# EAGLE design schematic (EAGLE 5.04)
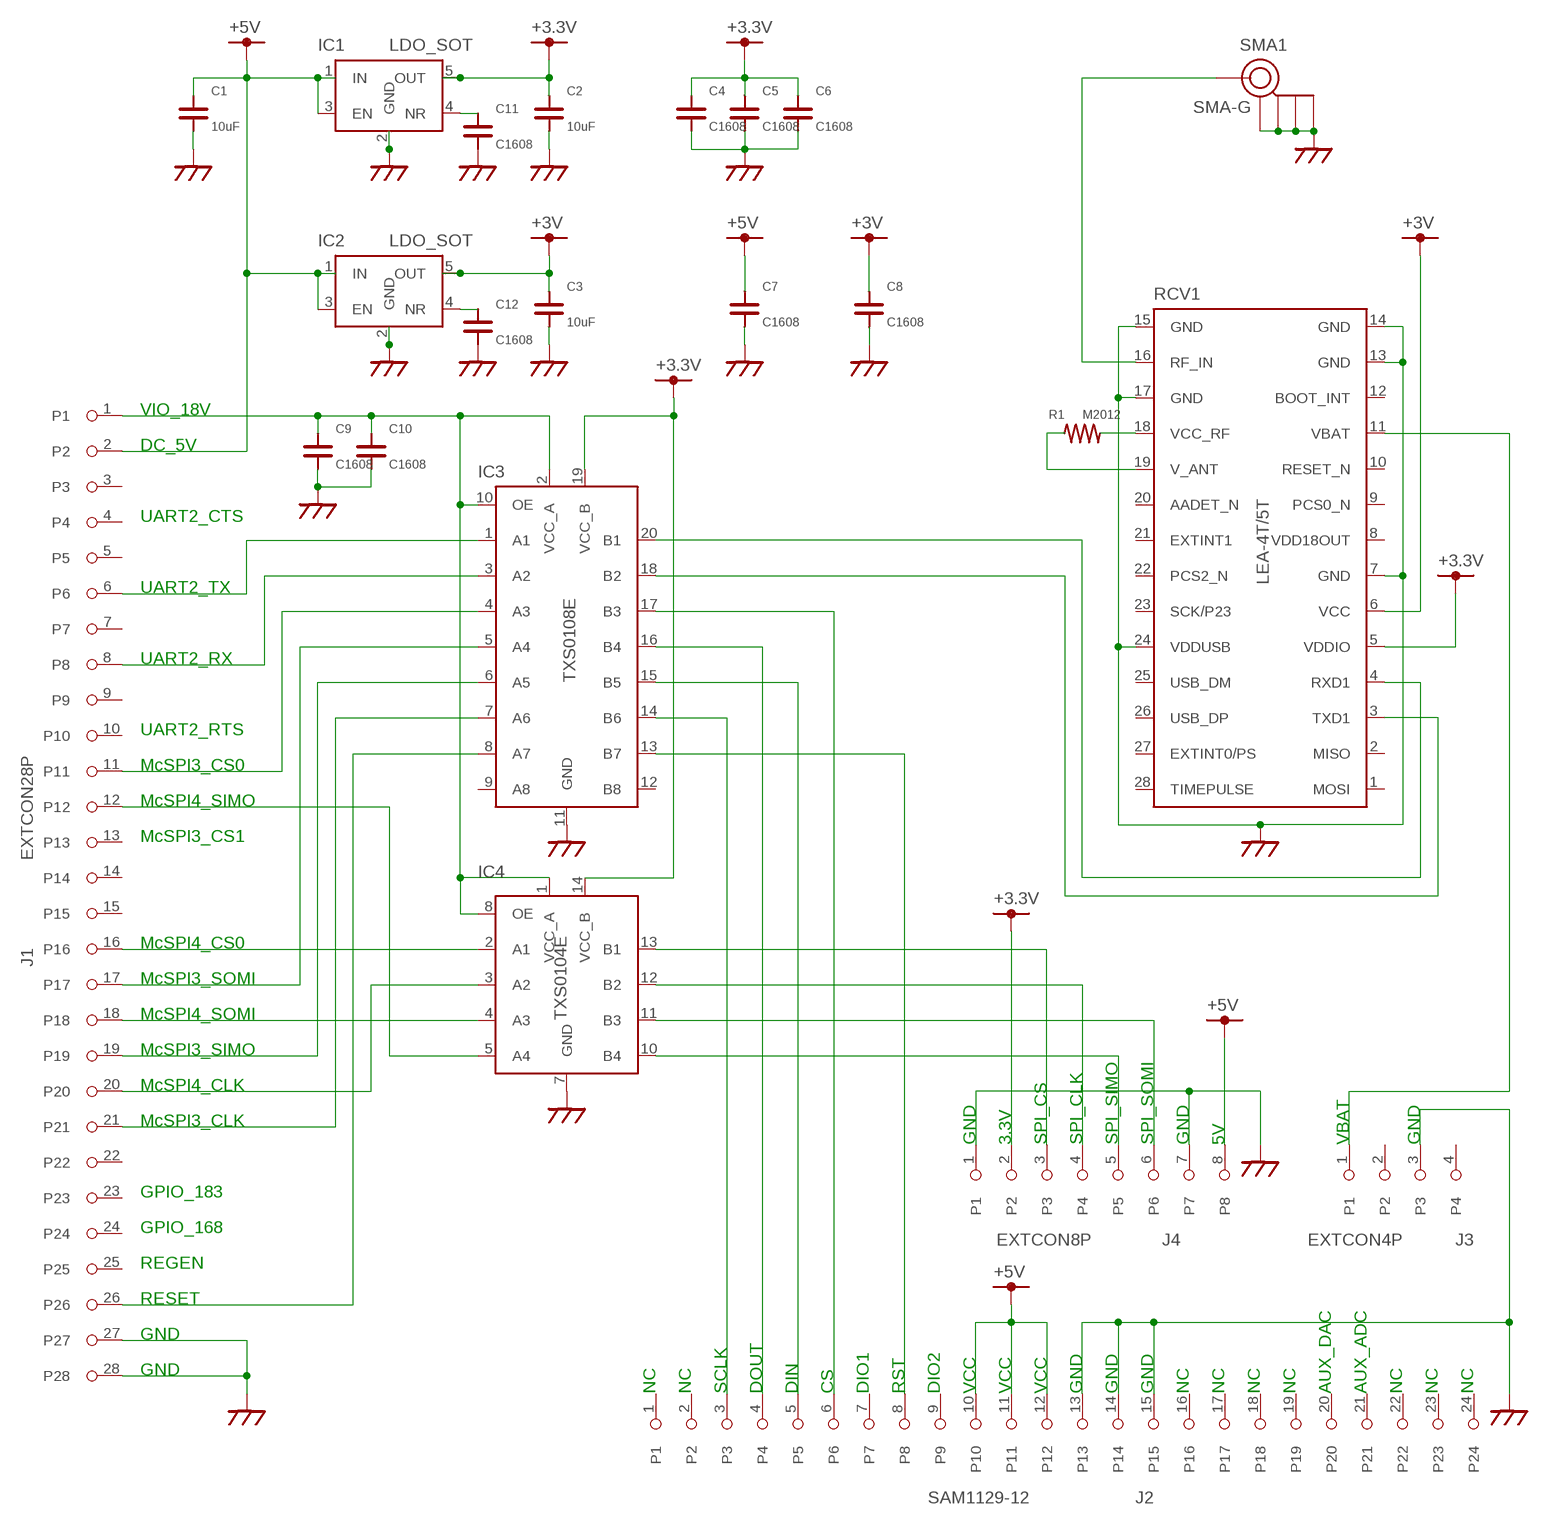
[diagram p0: schematic, sheet 1]

## Parts
C1  10uF  C3225  [C3225]
C2  10uF  C3225  [C3225]
C3  10uF  C3225  [C3225]
C4  C1608  [C1608]
C5  C1608  [C1608]
C6  C1608  [C1608]
C7  C1608  [C1608]
C8  C1608  [C1608]
C9  C1608  [C1608]
C10  C1608  [C1608]
C11  C1608  [C1608]
C12  C1608  [C1608]
IC1  LDO_SOT  [SOT23]
IC2  LDO_SOT  [SOT23]
IC3  TXS0108E  [SSOP20]
IC4  TXS0104E  [SSOP14]
J1  EXTCON28P  [EXTCON28P]
J2  SAM1129-12  [SAM1129-12]
J3  EXTCON4P  [PINH-2MM-4P]
J4  EXTCON8P  [PINH-2MM-8P]
R1  M2012  [M2012]
RCV1  LEA-4T/5T  LEA-4T  [LEA-4T]
SMA1  SMA-G  [SMA-G]

## Nets
1.8V [pow]: C9.1 C10.1 IC3.2(VCC_A) IC3.10(OE) IC4.1(VCC_A) IC4.8(OE) J1.1
+3.3V [pow]: C2.P$1 C4.1 C5.1 C6.1 IC1.5(OUT) IC3.19(VCC_B) IC4.14(VCC_B) J4.2 RCV1.5(VDDIO)
+3V [pow]: C3.P$1 C8.1 IC2.5(OUT) RCV1.6(VCC)
+5V [pow]: C1.P$1 C7.1 IC1.1(IN) IC1.3(EN) IC2.1(IN) IC2.3(EN) J1.2 J2.10 J2.11 J2.12 J4.8
GND [gnd]: C1.P$2 C2.P$2 C3.P$2 C4.2 C5.2 C6.2 C7.2 C8.2 C9.2 C10.2 C11.2 C12.2 IC1.2(GND) IC2.2(GND) IC3.11(GND) IC4.7(GND) J1.27 J1.28 J2.13 J2.14 J2.15 J3.3 J4.1 J4.7 RCV1.7(GND) RCV1.13(GND) RCV1.14(GND) RCV1.15(GND) RCV1.17(GND) RCV1.24(VDDUSB) SMA1.2(GND) SMA1.3(GND) SMA1.4(GND) SMA1.5(GND)
N$1: J3.1 RCV1.11(VBAT)
N$2: IC3.3(A2) J1.8
N$3: C12.1 IC2.4(NR)
N$4: IC3.1(A1) J1.6
N$5: IC3.4(A3) J1.11
N$6: R1.1 RCV1.19(V_ANT)
N$7: C11.1 IC1.4(NR)
N$8: IC3.20(B1) RCV1.4(RXD1)
N$9 [rf]: RCV1.16(RF_IN) SMA1.1(RF)
N$10: IC4.2(A1) J1.16
N$11: IC4.3(A2) J1.20
N$12: IC4.4(A3) J1.18
N$13: IC4.5(A4) J1.12
N$15: IC4.13(B1) J4.3
N$16: IC4.12(B2) J4.4
N$17: IC4.11(B3) J4.6
N$18: IC4.10(B4) J4.5
N$21: IC3.18(B2) RCV1.3(TXD1)
N$23: IC3.13(B7) J2.8
N$42: IC3.5(A4) J1.17
N$43: IC3.6(A5) J1.19
N$44: IC3.7(A6) J1.21
N$45: IC3.8(A7) J1.26
N$62: IC3.14(B6) J2.3
N$63: IC3.16(B4) J2.4
N$64: IC3.15(B5) J2.5
N$65: IC3.17(B3) J2.6
N$67: R1.2 RCV1.18(VCC_RF)
Unconnected: IC3.9(A8) IC3.12(B8) J1.3 J1.4 J1.5 J1.7 J1.9 J1.10 J1.13 J1.14 J1.15 J1.22 J1.23 J1.24 J1.25 J2.1 J2.2 J2.7 J2.9 J2.16 J2.17 J2.18 J2.19 J2.20 J2.21 J2.22 J2.23 J2.24 J3.2 J3.4 RCV1.1(MOSI) RCV1.2(MISO) RCV1.8(VDD18OUT) RCV1.9(PCS0_N) RCV1.10(RESET_N) RCV1.12(BOOT_INT) RCV1.20(AADET_N) RCV1.21(EXTINT1) RCV1.22(PCS2_N) RCV1.23(SCK/P23) RCV1.25(USB_DM) RCV1.26(USB_DP) RCV1.27(EXTINT0/PS) RCV1.28(TIMEPULSE)

## Notes on the sheet
- VIO_18V
- DC_5V
- UART2_CTS
- UART2_TX
- UART2_RX
- UART2_RTS
- McSPI3_CS0
- McSPI4_SIMO
- McSPI3_CS1
- McSPI4_CS0
- McSPI3_SOMI
- McSPI4_SOMI
- McSPI3_SIMO
- McSPI4_CLK
- McSPI3_CLK
- GND | 3.3V | SPI_CS | SPI_CLK | SPI_SIMO | SPI_SOMI | GND | 5V | VBAT | GND
- GPIO_183
- GPIO_168
- REGEN
- RESET
- GND
- GND
- NC | NC | SCLK | DOUT | DIN | CS | DIO1 | RST | DIO2 | VCC | VCC | VCC | GND | GND | GND | NC | NC | NC | NC | AUX_DAC | AUX_ADC | NC | NC | NC

## Library data of the parts
C1-C3 = ublox:C3225
C4-C12 = ublox:C1608
IC1 IC2 = ublox:LDO_SOT
IC3 = ublox:TXS0108E
IC4 = ublox:TXS0104E
J1 = ublox:EXTCON28P
J2 = ublox:SAM1129-12
J3 = ublox:EXTCON4P
J4 = ublox:EXTCON8P
R1 = ublox:M2012
RCV1 = ublox:LEA-4T: LEA-4T u-blox GPS receiver module
SMA1 = ublox:SMA-G: SMA-G

## Net classes
1 pow: width 0.254 mm
2 gnd: width 0.254 mm
3 rf: width 0.254 mm

## Board
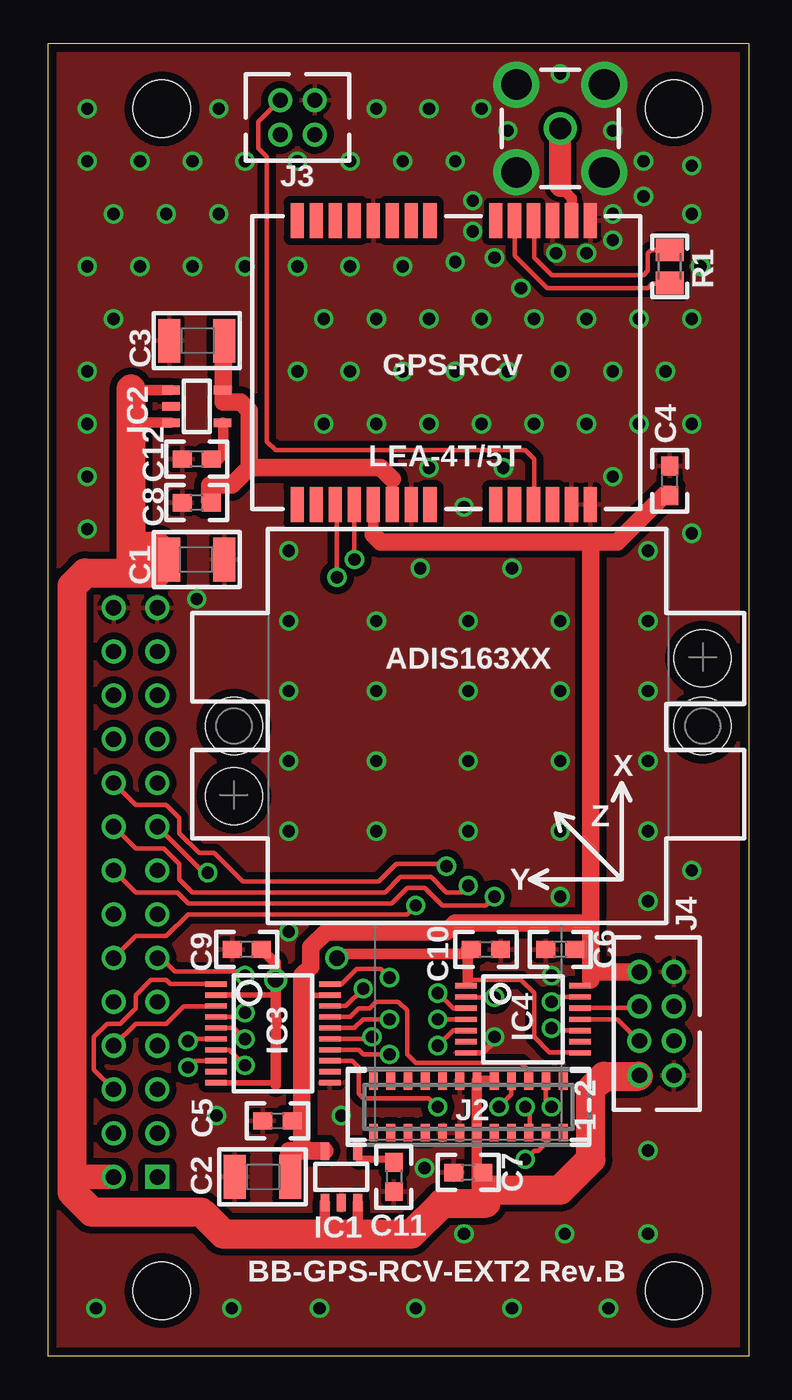
[diagram p1: board, top side]
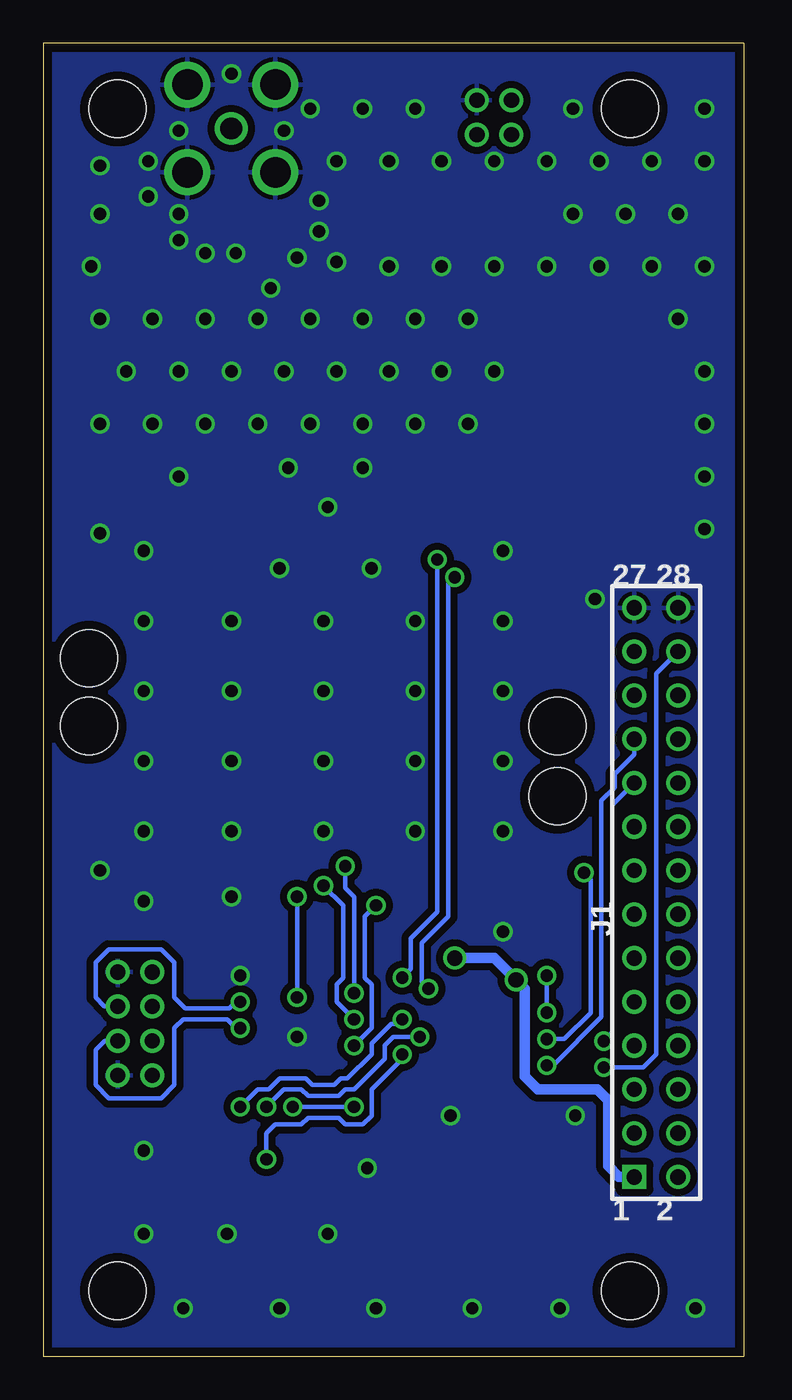
[diagram p2: board, bottom side, seen from below]

Size 40.64 x 76.2 mm. Coordinates in mm from the lower left corner, seen from the top.
Outline: 0,76.2 40.64,76.2 40.64,0 0,0 0,76.2
Copper layers (1*16): Top 0.0356mm / dielectric 1.5011mm / Bottom 0.0356mm
Design rules "SilverCircuits": minimum track width 8mil, minimum drill 24mil, track to track 12mil, track to pad 12mil, pad to pad 12mil, via to via 12mil, smd to smd 0mil, copper to edge 20mil, drill to drill 8mil, minimum pad ring 10mil, minimum via ring 8mil, stop-mask expansion 4mil, vias tented up to drill 0mil, thermal gap 10mil
Holes 3.3 mm at 6.6,72.39 6.6,3.81 36.32,3.81 36.32,72.39 10.79,32.51 37.97,40.51 37.97,36.58 10.79,36.58

### Footprints (pad centres in the part's own frame; a part is rotated, then mirrored left to right if it is on the bottom)
C3225 = smd 2.54 x 1.27: P$1 0,1.6; P$2 0,-1.6
C1608 = smd 1.1 x 1: 1 -0.85,0; 2 0.85,0
SOT23 = smd 0.508 x 1.016: 1 -0.95,-1.5; 2 0,-1.5; 3 0.95,-1.5; 4 0.95,1.5; 5 -0.95,1.5
SSOP20 = smd 0.305 x 1.245: 1 -2.857,-3.302; 2 -2.222,-3.302; 3 -1.587,-3.302; 4 -0.952,-3.302; 5 -0.317,-3.302; 6 0.318,-3.302; 7 0.953,-3.302; 8 1.588,-3.302; 9 2.223,-3.302; 10 2.858,-3.302; 11 2.858,3.302; 12 2.223,3.302; 13 1.588,3.302; 14 0.953,3.302; 15 0.318,3.302; 16 -0.317,3.302; 17 -0.952,3.302; 18 -1.587,3.302; 19 -2.222,3.302; 20 -2.857,3.302
SSOP14 = smd 0.304 x 1.245: 1 -1.95,-3.3; 2 -1.3,-3.3; 3 -0.65,-3.3; 4 0,-3.3; 5 0.65,-3.3; 6 1.3,-3.3; 7 1.95,-3.3; 8 1.95,3.3; 9 1.3,3.3; 10 0.65,3.3; 11 0,3.3; 12 -0.65,3.3; 13 -1.3,3.3; 14 -1.95,3.3
EXTCON28P = drill 0.889 square: 1 -1.27,-16.51 | drill 0.889 round: 2 1.27,-16.51; 3 -1.27,-13.97; 4 1.27,-13.97; 5 -1.27,-11.43; 6 1.27,-11.43; 7 -1.27,-8.89; 8 1.27,-8.89; 9 -1.27,-6.35; 10 1.27,-6.35; 11 -1.27,-3.81; 12 1.27,-3.81; 13 -1.27,-1.27; 14 1.27,-1.27; 15 -1.27,1.27; 16 1.27,1.27; 17 -1.27,3.81; 18 1.27,3.81; 19 -1.27,6.35; 20 1.27,6.35; 21 -1.27,8.89; 22 1.27,8.89; 23 -1.27,11.43; 24 1.27,11.43; 25 -1.27,13.97; 26 1.27,13.97; 27 -1.27,16.51; 28 1.27,16.51
SAM1129-12 = smd 1.016 x 0.508: 1 -1.5,-5.5; 2 1.5,-5.5; 3 -1.5,-4.5; 4 1.5,-4.5; 5 -1.5,-3.5; 6 1.5,-3.5; 7 -1.5,-2.5; 8 1.5,-2.5; 9 -1.5,-1.5; 10 1.5,-1.5; 11 -1.5,-0.5; 12 1.5,-0.5; 13 -1.5,0.5; 14 1.5,0.5; 15 -1.5,1.5; 16 1.5,1.5; 17 -1.5,2.5; 18 1.5,2.5; 19 -1.5,3.5; 20 1.5,3.5; 21 -1.5,4.5; 22 1.5,4.5; 23 -1.5,5.5; 24 1.5,5.5
PINH-2MM-4P = drill 0.889 round: 1 1,-1; 2 1,1; 3 -1,-1; 4 -1,1
PINH-2MM-8P = drill 0.889 round: 1 3,-1; 2 3,1; 3 1,-1; 4 1,1; 5 -1,-1; 6 -1,1; 7 -3,-1; 8 -3,1
M2012 = smd 1.3 x 1.6: 1 -0.95,0; 2 0.95,0
LEA-4T = smd 2.032 x 0.762: 1 8.246,-8.65; 2 8.246,-7.55; 3 8.246,-6.45; 4 8.246,-5.35; 5 8.246,-4.25; 6 8.246,-3.15; 7 8.246,-2.05; 8 8.246,-0.95; 9 8.246,2.85; 10 8.246,3.95; 11 8.246,5.05; 12 8.246,6.15; 13 8.246,7.25; 14 8.246,8.35; 15 -8.246,8.35; 16 -8.246,7.25; 17 -8.246,6.15; 18 -8.246,5.05; 19 -8.246,3.95; 20 -8.246,2.85; 21 -8.246,-0.95; 22 -8.246,-2.05; 23 -8.246,-3.15; 24 -8.246,-4.25; 25 -8.246,-5.35; 26 -8.246,-6.45; 27 -8.246,-7.55; 28 -8.246,-8.65
SMA-G = drill 1.27 round: 1 0,0 | drill 1.778 round: 2 -2.55,2.55; 3 2.55,2.55; 4 2.55,-2.55; 5 -2.55,-2.55

### Placement (x,y rotation side)
ADIS163XX  [ADIS]  24.38,36.58 0 top
C1  8.64,46.23 90 top
C2  12.45,10.41 270 top
C3  8.64,58.93 270 top
C4  36.07,50.8 90 top
C5  13.31,13.67 180 top
C6  29.72,23.62 180 top
C7  24.38,10.67 180 top
C8  8.64,49.53 180 top
C9  11.53,23.62 180 top
C10  25.4,23.62 0 top
C11  20.07,10.41 270 top
C12  8.64,52.07 180 top
IC1  17.02,10.41 0 top
IC2  8.64,55.12 270 top
IC3  13.06,18.75 270 top
IC4  27.56,19.56 270 top
J1  5.08,26.92 0 bottom
J2  24.38,14.48 90 top
J3  14.48,71.88 180 top
J4  35.31,19.3 90 top
R1  36.07,63.25 90 top
RCV1  23.11,57.66 270 top
SMA1  29.72,71.25 180 top

### Tracks (layer width: path | path; a pad name or v marks a point on that pad's centre or on a via)
1.8V  (via drill 0.89)
  Top 0.254: 24.34,21.84 27.43,21.84 28.19,21.08 28.19,18.54 29.08,17.65 30.86,17.65 IC4.8 | 9.77,15.88 IC3.10
  Top 0.305: 24.34,21.59 IC4.1 | IC3.2 13.09,20.97 13.21,21.08 | 9.77,15.88 13.08,15.88 13.21,16
  Top 0.406: C10.1 24.64,23.62 | 24.38,23.37 24.38,23.46 | 24.34,21.84 24.34,21.59
  Top 0.61: v16.76,23.11 17.02,23.37 24.38,23.37 | 24.34,21.84 24.34,23.41 24.38,23.46 | 13.21,15.75 13.21,16 13.21,21.08 v13.21,21.84 13.21,22.86 13.14,22.86 C9.1 12.45,23.56
  Top 1.016: 24.38,23.46 C10.1
  Bottom 0.61: v16.76,23.11 14.48,23.11 v13.21,21.84 12.7,21.34 12.7,16.26 11.94,15.49 8.51,15.49 7.87,14.86 7.87,11.05 7.24,10.41 J1.1
+3.3V
  Top 0.305: IC3.19 16.34,20.95 14.86,20.95 | IC4.14 31.16,21.51 31.5,21.84
  Top 0.61: 18.86,47.68 RCV1.5 | 14.73,21.08 14.86,20.95
  Top 1.016: 31.5,47.24 33.02,47.24 35.81,50.04 35.98,50.04 C4.1 36.07,50.04 | 14.73,11.94 14.73,13.72 | 14.73,13.72 14.73,21.08 14.73,22.1 15.24,22.61 15.24,23.75 16.13,24.64 23.11,24.64 23.62,25.15 31.5,25.15 | 14.17,13.66 C5.1 14.68,13.66 14.73,13.72 | 14.48,11.94 14.45,11.91 14.73,11.91 | 31.5,47.24 19.3,47.24 18.86,47.68 | 31.5,23.62 C6.1 | 14.73,11.91 IC1.5 | C2.P$1 14.05,10.85 13.97,10.92 13.97,11.94 14.73,11.94 | 31.5,25.15 31.5,47.24 | 14.73,11.94 14.73,11.91 | 31.5,23.62 31.5,22.35 | 31.5,22.35 31.5,21.84 | J4.2 31.54,22.3 31.5,22.35 | 31.5,25.15 31.5,23.62
+3V
  Top 0.61: 19.96,50.9 RCV1.6
  Top 1.016: 19.96,50.9 19.3,51.56 11.68,51.56 | 11.68,51.56 11.68,54.86 11.18,55.37 10.16,55.37 10.16,56.13 | 10.14,58.83 C3.P$1 10.16,58.85 10.16,56.13 | 11.68,51.56 10.67,50.55 9.4,50.55 9.4,49.62 C8.1 | IC2.5 10.14,56.11 10.16,56.13
+5V
  Top 0.61: 18.03,7.11 17.97,7.18 IC1.3 | 16,7.11 16.07,7.18 IC1.1 | J2.10 J2.12 J2.11 24.88,10.92 | 24.88,10.92 24.88,9.75 25.4,9.75 25.4,9.65 | C7.1 24.88,10.67 24.88,10.92 | 4.89,56.07 IC2.1 | 5.01,54.17 IC2.3
  Top 0.813: 4.83,56.13 4.89,56.07 | 4.83,54.36 5.01,54.17 | 6.35,46.23 C1.P$1
  Top 1.016: 34.29,16.29 J4.8 34.26,16.26
  Top 1.422: 4.83,47.24 4.83,46.99 | 4.83,45.72 4.83,46.74 5.08,46.99 | 1.4,10.41 J1.2
  Top 1.676: 4.83,45.72 4.83,47.24 4.83,54.36 4.83,56.13 | 5.08,46.99 6.35,46.99 6.35,46.23 6.35,45.47 2.16,45.47 1.4,44.7 1.4,10.41 1.4,9.53 2.54,8.38 8.89,8.38 10.16,7.11 16,7.11 18.03,7.11 21.08,7.11 22.86,8.89 25.4,8.89 25.4,9.65 29.72,9.65 31.5,11.43 31.5,15.49 32.26,16.26 34.26,16.26
GND  (via drill 0.71)
  Top 0.305: IC4.7 25.23,17.61 25.91,18.29
  Top 0.406: 25.91,18.29 v25.91,18.54
  other vias: 29.21,22.1 32.51,2.79 14.48,63.25 17.53,63.25 24.64,67.06 23.62,63.5 32.77,64.77 32.77,66.29 37.34,66.29 23.62,69.34 34.29,60.2 31.24,60.2 28.19,60.2 25.15,60.2 22.1,60.2 19.05,60.2 16,60.2 32.77,51.05 14.48,57.15 17.53,57.15 20.57,57.15 23.62,57.15 26.67,57.15 29.72,57.15 32.77,57.15 35.81,57.15 31.24,54.1 28.19,54.1 25.15,54.1 22.1,54.1 19.05,54.1 16,54.1 24.13,49.28 25.91,63.75 24.64,65.28 29.46,64.01 37.34,69.09 34.29,54.1 20.57,63.25 34.54,67.31 34.54,69.34 32.77,71.12 29.72,74.42 26.67,71.12 25.15,72.39 27.43,61.98 22.1,72.39 19.05,72.39 20.57,69.34 17.53,69.34 14.48,69.34 34.8,11.94 37.34,28.19 11.43,69.34 26.42,51.56 11.43,63.25 9.91,66.29 37.34,60.2 29.97,7.11 29.72,42.67 13.97,42.67 29.72,26.67 5.33,69.34 24.38,42.67 34.8,7.11 24.38,38.61 9.78,13.97 19.05,42.67 22.1,51.56 29.72,38.61 13.97,34.54 15.75,2.79 24.13,7.11 37.34,47.75 26.92,2.79 10.67,2.79 8.38,69.34 37.34,54.1 6.86,66.29 3.81,66.29 9.91,72.39 2.29,69.34 2.29,63.25 2.29,51.05 31.24,64.01 13.97,46.74 13.97,38.61 13.97,24.64 13.97,30.48 21.84,10.92 19.05,34.54 19.05,30.48 21.34,2.79 34.8,26.42 34.8,30.48 34.8,34.54 34.8,38.61 34.8,42.67 2.79,2.79 19.05,38.61 26.92,45.72 21.59,45.72 29.72,34.54 29.72,30.48 24.38,30.48 24.38,34.54 2.29,57.15 2.29,54.1 2.29,48.01 2.29,72.39 8.38,63.25 3.81,60.2 8.64,43.94 37.85,63.25 34.8,46.74 17.02,13.97 5.33,63.25
  pour Bottom (isolate 0.406): -1.78,77.98 42.42,77.98 42.42,-2.03 -1.78,-2.03
  pour Top (isolate 0.406): -0.76,76.96 25.4,76.96 25.4,66.8 34.04,66.8 34.04,76.96 41.4,76.96 41.4,-1.02 -0.76,-1.02
  pour Top (isolate 0.254, no thermals): 23.62,77.72 23.62,66.29 35.81,66.29 35.81,77.72
N$1
  Top 0.254: RCV1.11 28.19,49.44 28.19,52.07 27.69,52.58 13.21,52.58 12.7,53.09 12.7,69.6 12.19,70.1 12.19,71.63 13.19,72.63 13.22,72.63 J3.1
N$2
  Top 0.254: J1.8 5.08,19.3 6.86,19.3 7.87,20.32 IC3.3
N$3
  Top 0.61: IC2.4 10.14,54.13 10.16,54.1 10.16,52.32 9.91,52.07 C12.1
N$4
  Top 0.254: IC3.1 7.1,21.6 6.86,21.84 5.97,21.84 5.08,20.95 5.08,20.19 4.19,19.3 3.43,19.3 2.67,18.54 2.67,16.64 J1.6
N$5  (via drill 0.71)
  Top 0.254: J1.11 6.6,23.11 7.37,22.35 11.18,22.35 v11.43,22.1 | v11.43,19.94 11.18,19.68 9.77,19.68 IC3.4
  Bottom 0.254: v11.43,19.94 v11.43,22.1
N$6
  Top 0.254: RCV1.19 27.06,63.87 28.96,61.98 34.8,61.98 35.05,62.23 36,62.23 R1.1
N$7
  Top 0.406: IC1.4 17.97,11.5 18.03,11.43 19.9,11.43 C11.1
N$8  (via drill 0.71)
  Top 0.254: v19.81,21.97 19.3,22.48 17.91,22.48 17.02,21.59 IC3.20 | v17.78,46.23 17.78,49.4 RCV1.4
  Bottom 0.254: v17.78,46.23 17.78,25.78 19.3,24.26 19.3,22.48 v19.81,21.97
N$9
  Top 0.61: 29.72,67.87 30.38,67.21 30.38,66.8 | 30.38,66.8 30.38,66.17 | RCV1.16 30.36,66.79 30.38,66.8
  Top 0.813: 29.72,67.87 29.72,67.92
  Top 1.27: 29.72,67.92 SMA1.1
N$10  (via drill 0.71)
  Top 0.254: v25.91,20.83 24.23,20.83 IC4.2 | J1.16 5.08,26.92 7.49,26.92 8.13,26.29 19.94,26.29 20.83,27.18 21.84,27.18 22.86,26.16 25.4,26.16 v25.91,26.67
  Bottom 0.254: v25.91,26.67 v25.91,20.83
N$11  (via drill 0.71)
  Top 0.254: IC4.3 24.27,20.19 23.5,20.19 v22.61,21.08 | J1.20 5.08,32 6.86,32 7.62,31.24 7.62,30.35 8.76,29.21 9.65,29.21 11.3,27.56 19.18,27.56 20.19,28.57 22.99,28.57 v23.11,28.45
  Bottom 0.254: v23.11,28.45 23.11,27.18 22.61,26.67 v22.61,21.08
N$12  (via drill 0.71)
  Top 0.254: v22.61,19.56 IC4.4 | v24.38,27.3 24,26.92 23.11,26.92 22.23,27.81 20.45,27.81 19.56,26.92 8.38,26.92 7.62,27.69 7.62,28.57 6.73,29.46 5.08,29.46 J1.18
  Bottom 0.254: v22.61,19.56 23.62,20.57 23.62,21.59 23.24,21.97 23.24,26.16 v24.38,27.3
N$13  (via drill 0.71)
  Top 0.254: 24.24,18.91 IC4.5 24.24,18.92 23.5,18.92 v22.61,18.03 | J1.12 5.08,24.38 6.86,24.38 8.13,25.65 20.83,25.65 v21.34,26.16
  Bottom 0.254: v22.61,18.03 21.59,19.05 21.59,21.59 21.97,21.97 21.97,25.53 v21.34,26.16
N$15  (via drill 0.71)
  Top 0.254: 30.89,20.83 IC4.13 29.49,20.86 v29.21,20.57
  Bottom 0.254: v29.21,20.57 29.46,20.57 29.84,20.19 32.38,20.19 33.02,20.83 33.02,22.86 33.78,23.62 36.83,23.62 37.59,22.86 37.59,20.83 37.08,20.32 36.32,20.32 J4.3
N$16
  Top 0.254: IC4.12 34.21,20.21 J4.4
N$17
  Top 0.254: J4.6 34.27,18.3 33.02,19.56 IC4.11
N$18  (via drill 0.71)
  Top 0.254: IC4.10 29.35,18.91 v29.21,19.05
  Bottom 0.254: v29.21,19.05 29.46,19.05 29.97,19.56 32.51,19.56 33.02,19.05 33.02,15.75 33.78,14.99 36.83,14.99 37.59,15.75 37.59,17.78 37.07,18.3 J4.5
N$21  (via drill 0.71)
  Top 0.254: v18.29,21.34 17.28,20.33 IC3.18 | v16.76,45.21 16.76,49.31 RCV1.3
  Bottom 0.254: v16.76,45.21 17.14,44.83 17.14,25.53 18.67,24 18.67,21.72 v18.29,21.34
N$23  (via drill 0.71)
  Top 0.254: IC3.13 17.64,17.16 18.03,16.76 18.03,15.24 18.29,14.99 22.1,14.99 v22.61,14.48 | J2.8 26.88,15.2 v26.16,14.48
  Bottom 0.254: v22.61,14.48 v26.16,14.48
N$42  (via drill 0.71)
  Top 0.254: IC3.5 10.78,19.06 v11.43,18.41 | v9.27,28.07 9.02,28.07 J1.17
  Bottom 0.254: v9.27,28.07 8.89,27.69 8.89,19.94 10.41,18.41 v11.43,18.41
N$43  (via drill 0.71)
  Top 0.254: IC3.6 8.27,18.43 v8.13,18.29
  Bottom 0.254: J1.19 7.62,32 7.62,18.8 v8.13,18.29
N$44  (via drill 0.71)
  Top 0.254: IC3.7 10.53,17.79 v11.43,16.89
  Bottom 0.254: J1.21 6.35,34.92 7.49,33.78 7.49,33.02 8.26,32.26 8.26,19.68 11.05,16.89 v11.43,16.89
N$45  (via drill 0.71)
  Top 0.254: IC3.8 8.52,17.16 v8.13,16.76
  Bottom 0.254: v8.13,16.76 5.84,16.76 5.08,17.53 5.08,39.62 J1.26
N$62  (via drill 0.71)
  Top 0.254: IC3.14 18.02,17.79 18.29,17.53 v19.81,17.53 | v27.69,11.43 28.19,11.94 28.45,11.94 28.96,12.45 28.96,12.91 J2.3
  Bottom 0.254: v19.81,17.53 19.81,17.27 21.59,15.49 21.59,13.97 22.1,13.46 23.11,13.46 23.5,13.84 25.27,13.84 25.65,13.46 27.18,13.46 27.69,12.95 v27.69,11.43
N$63  (via drill 0.71)
  Top 0.254: v19.81,19.56 18.29,19.56 17.78,19.05 IC3.16 | J2.4 28.88,14.8 v29.21,14.48
  Bottom 0.254: v29.21,14.48 28.19,15.49 27.56,15.49 26.92,16.13 25.4,16.13 25.02,15.75 23.75,15.75 23.37,16.13 22.99,16.13 21.59,17.53 21.59,18.16 20.45,19.3 20.07,19.3 v19.81,19.56
N$64  (via drill 0.71)
  Top 0.254: v18.8,18.54 18.67,18.54 18.54,18.41 16.37,18.41 IC3.15 | v27.69,14.48 27.94,14.22 27.94,13.03 J2.5
  Bottom 0.254: v27.69,14.48 26.67,15.49 25.65,15.49 25.27,15.11 23.5,15.11 23.11,15.49 22.61,15.49 20.83,17.27 20.83,18.03 20.32,18.54 v18.8,18.54
N$65
  Top 0.254: IC3.17 17.54,19.7 18.03,20.19 18.67,20.19 19.05,20.57 20.32,20.57 20.83,20.07 20.83,17.53 21.34,17.02 27.43,17.02 27.94,16.51 27.94,16.03 J2.6
N$67
  Top 0.254: R1.2 34.99,64.2 34.8,64.01 34.8,62.99 34.54,62.74 29.21,62.74 28.19,63.75 28.19,65.87 RCV1.18

### Text on the board
tPlace: BB-GPS-RCV-EXT2 Rev.B